# Altium schematic sheet slapcie.SchDoc
size A4
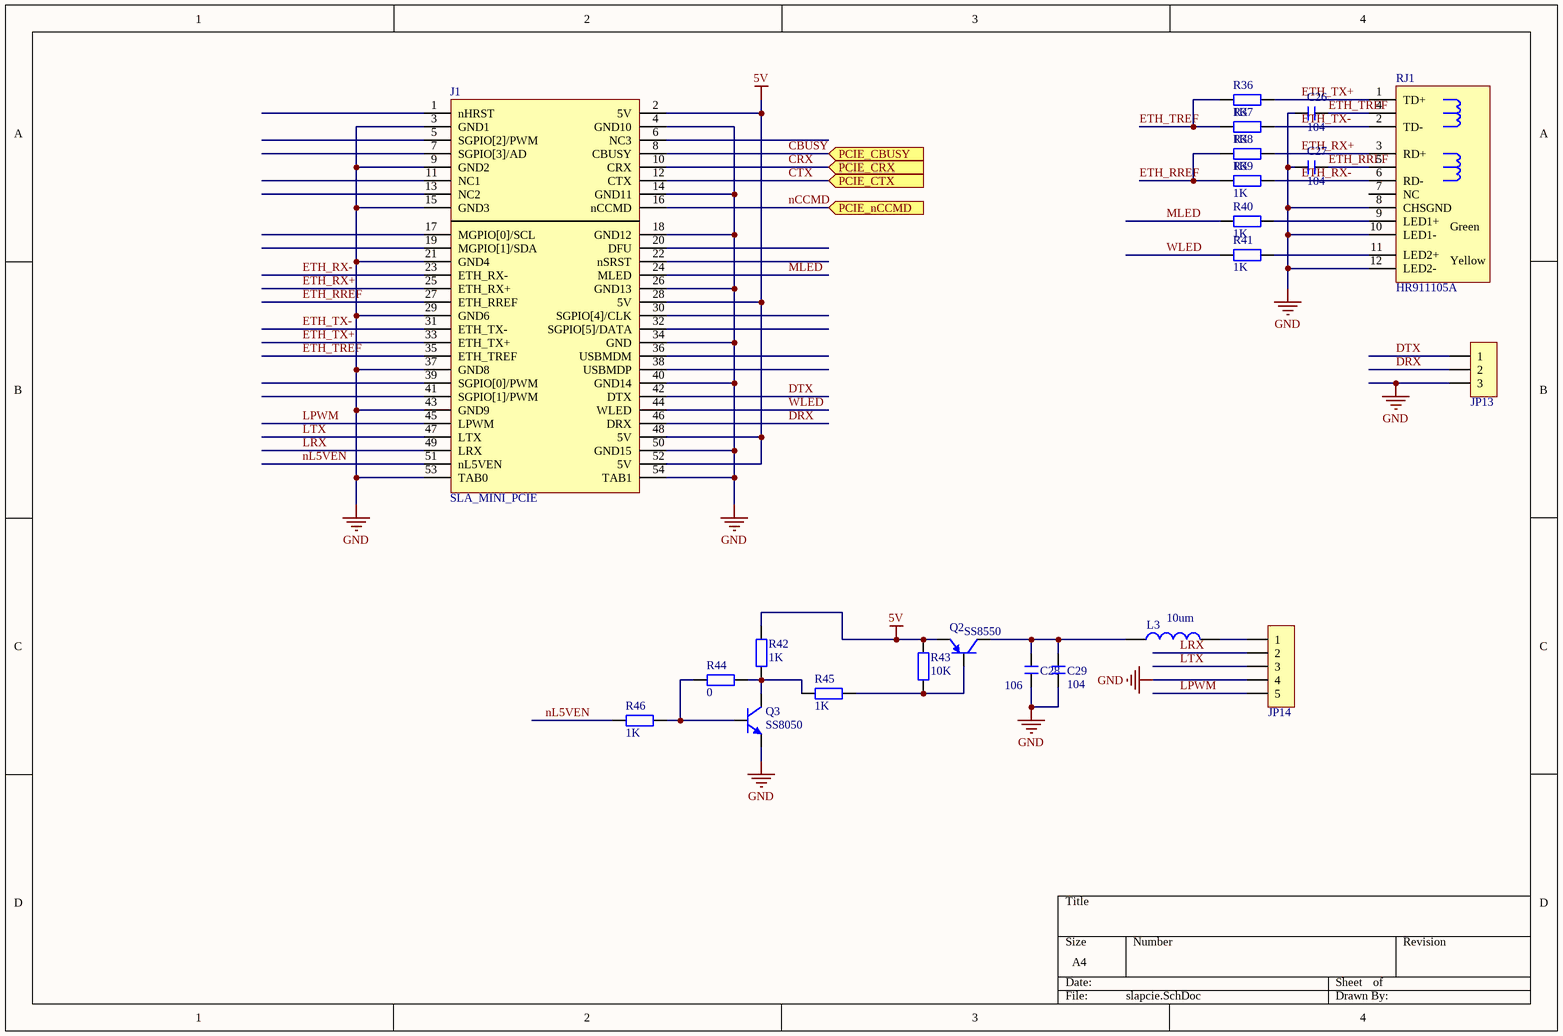
[diagram p0: slapcie.SchDoc]

## Parts
C26  104  [C 0603_L]
C27  104  [C 0603_L]
C28  106  [C 0603_L]
C29  104  [C 0603_L]
J1  SLA_MINI_PCIE  [MINI_PCIE]
JP13  HDR-1X3  [XH2.54-LI-3P]  (value not drawn)
JP14  HDR-1X5  [XH2.54-WI-5P]  (value not drawn)
L3  10um  [L 0805]
Q2  SS8550  [SOT23-3N]
Q3  SS8050  [SOT23-3N]
R36  1K  [R 0603_L]
R37  1K  [R 0603_L]
R38  1K  [R 0603_L]
R39  1K  [R 0603_L]
R40  1K  [R 0603_L]
R41  1K  [R 0603_L]
R42  1K  [R 0603_L]
R43  10K  [R 0603_L]
R44  0  [R 0603_L]
R45  1K  [R 0603_L]
R46  1K  [R 0603_L]
RJ1  HR911105A  [RJ-45A12]

## Ports
PCIE_CBUSY (in), PCIE_CRX (in), PCIE_CTX (in), PCIE_nCCMD (in)

## Nets
5V: J1.2(5V) J1.28(5V) J1.48(5V) J1.52(5V) Q2.2(E) R42.2 R43.2
GND: C26.1 C27.1 C28.1 C29.2 J1.3(GND1) J1.4(GND10) J1.9(GND2) J1.14(GND11) J1.15(GND3) J1.18(GND12) J1.21(GND4) J1.26(GND13) J1.29(GND6) J1.34(GND) J1.37(GND8) J1.40(GND14) J1.43(GND9) J1.50(GND15) J1.53(TAB0) J1.54(TAB1) JP13.3 JP14.4 Q3.2(E) RJ1.8(CHSGND) RJ1.10(LED1-) RJ1.12(LED2-)
CBUSY: J1.8(CBUSY) ; port PCIE_CBUSY
CRX: J1.10(CRX) ; port PCIE_CRX
CTX: J1.12(CTX) ; port PCIE_CTX
DRX: J1.46(DRX) JP13.2
DTX: J1.42(DTX) JP13.1
ETH_RREF: C27.2 J1.27(ETH_RREF) R38.1 R39.1 RJ1.5
ETH_RX+: J1.25(ETH_RX+) R38.2 RJ1.3(RD+)
ETH_RX-: J1.23(ETH_RX-) R39.2 RJ1.6(RD-)
ETH_TREF: C26.2 J1.35(ETH_TREF) R36.1 R37.1 RJ1.4
ETH_TX+: J1.33(ETH_TX+) R36.2 RJ1.1(TD+)
ETH_TX-: J1.31(ETH_TX-) R37.2 RJ1.2(TD-)
LPWM: J1.45(LPWM) JP14.5
LRX: J1.49(LRX) JP14.2
LTX: J1.47(LTX) JP14.3
MLED: J1.24(MLED) R40.1
nCCMD: J1.16(nCCMD) ; port PCIE_nCCMD
nL5VEN: J1.51(nL5VEN) R46.1
WLED: J1.44(WLED) R41.1
NetC28_2: C28.2 C29.1 L3.1 Q2.3(C)
NetJP14_1: JP14.1 L3.2
NetQ2_1: Q2.1(B) R43.1 R45.2
NetQ3_1: Q3.1(B) R44.1 R46.2
NetQ3_3: Q3.3(C) R42.1 R44.2 R45.1
NetR40_2: R40.2 RJ1.9(LED1+)
NetR41_2: R41.2 RJ1.11(LED2+)

Not connected (* = marked no-connect by the designer): J1 1(nHRST) 5(SGPIO[2]/PWM) 6(NC3) 7(SGPIO[3]/AD) 11(NC1) 13(NC2) 17(MGPIO[0]/SCL) 19(MGPIO[1]/SDA) 20(DFU) 22(nSRST) 30(SGPIO[4]/CLK) 32(SGPIO[5]/DATA) 36(USBMDM) 38(USBMDP) 39(SGPIO[0]/PWM) 41(SGPIO[1]/PWM); RJ1 7(NC)

## Notes on the sheet
- (in symbol HR911105A) Green; Yellow

## Library data of the parts
C26-C29 = C: 无极性贴片电容; 版权归属: 源创客; BOM名称: 无极性贴片电容; 学习资源: www.ooocke.com
J1 = SLA_PCIE
JP13 = Header 3: 3P接插件; 版权归属: 源创客; BOM名称: 3P接插件; 学习资源: www.ooocke.com
JP14 = Header 5: 5P接插件; 版权归属: 源创客; BOM名称: 5P接插件; 学习资源: www.ooocke.com
L3 = L: 小功率贴片电感; 版权归属: 源创客; BOM名称: 小功率贴片电感; 学习资源: www.ooocke.com
Q2 = 8550-SMD: 高频放大-PNP型; 版权归属: 源创客; 属性: 40V 1.5A 1W 100MHZ; BOM名称: 高频放大-PNP型; 学习资源: www.ooocke.com
Q3 = 8050-SMD: 高频放大-NPN型; 版权归属: 源创客; 属性: 40V 1.5A 1W 100MHZ; BOM名称: 高频放大-NPN型; 学习资源: www.ooocke.com
R36-R46 = R: 贴片电阻; 版权归属: 源创客; BOM名称: 贴片电阻; 学习资源: www.ooocke.com
RJ1 = HR911105A: 带灯以太网接口; 版权归属: 源创客; BOM名称: 带灯以太网接口; 学习资源: www.ooocke.com